# EAGLE design ROME (EAGLE 9.6.2)
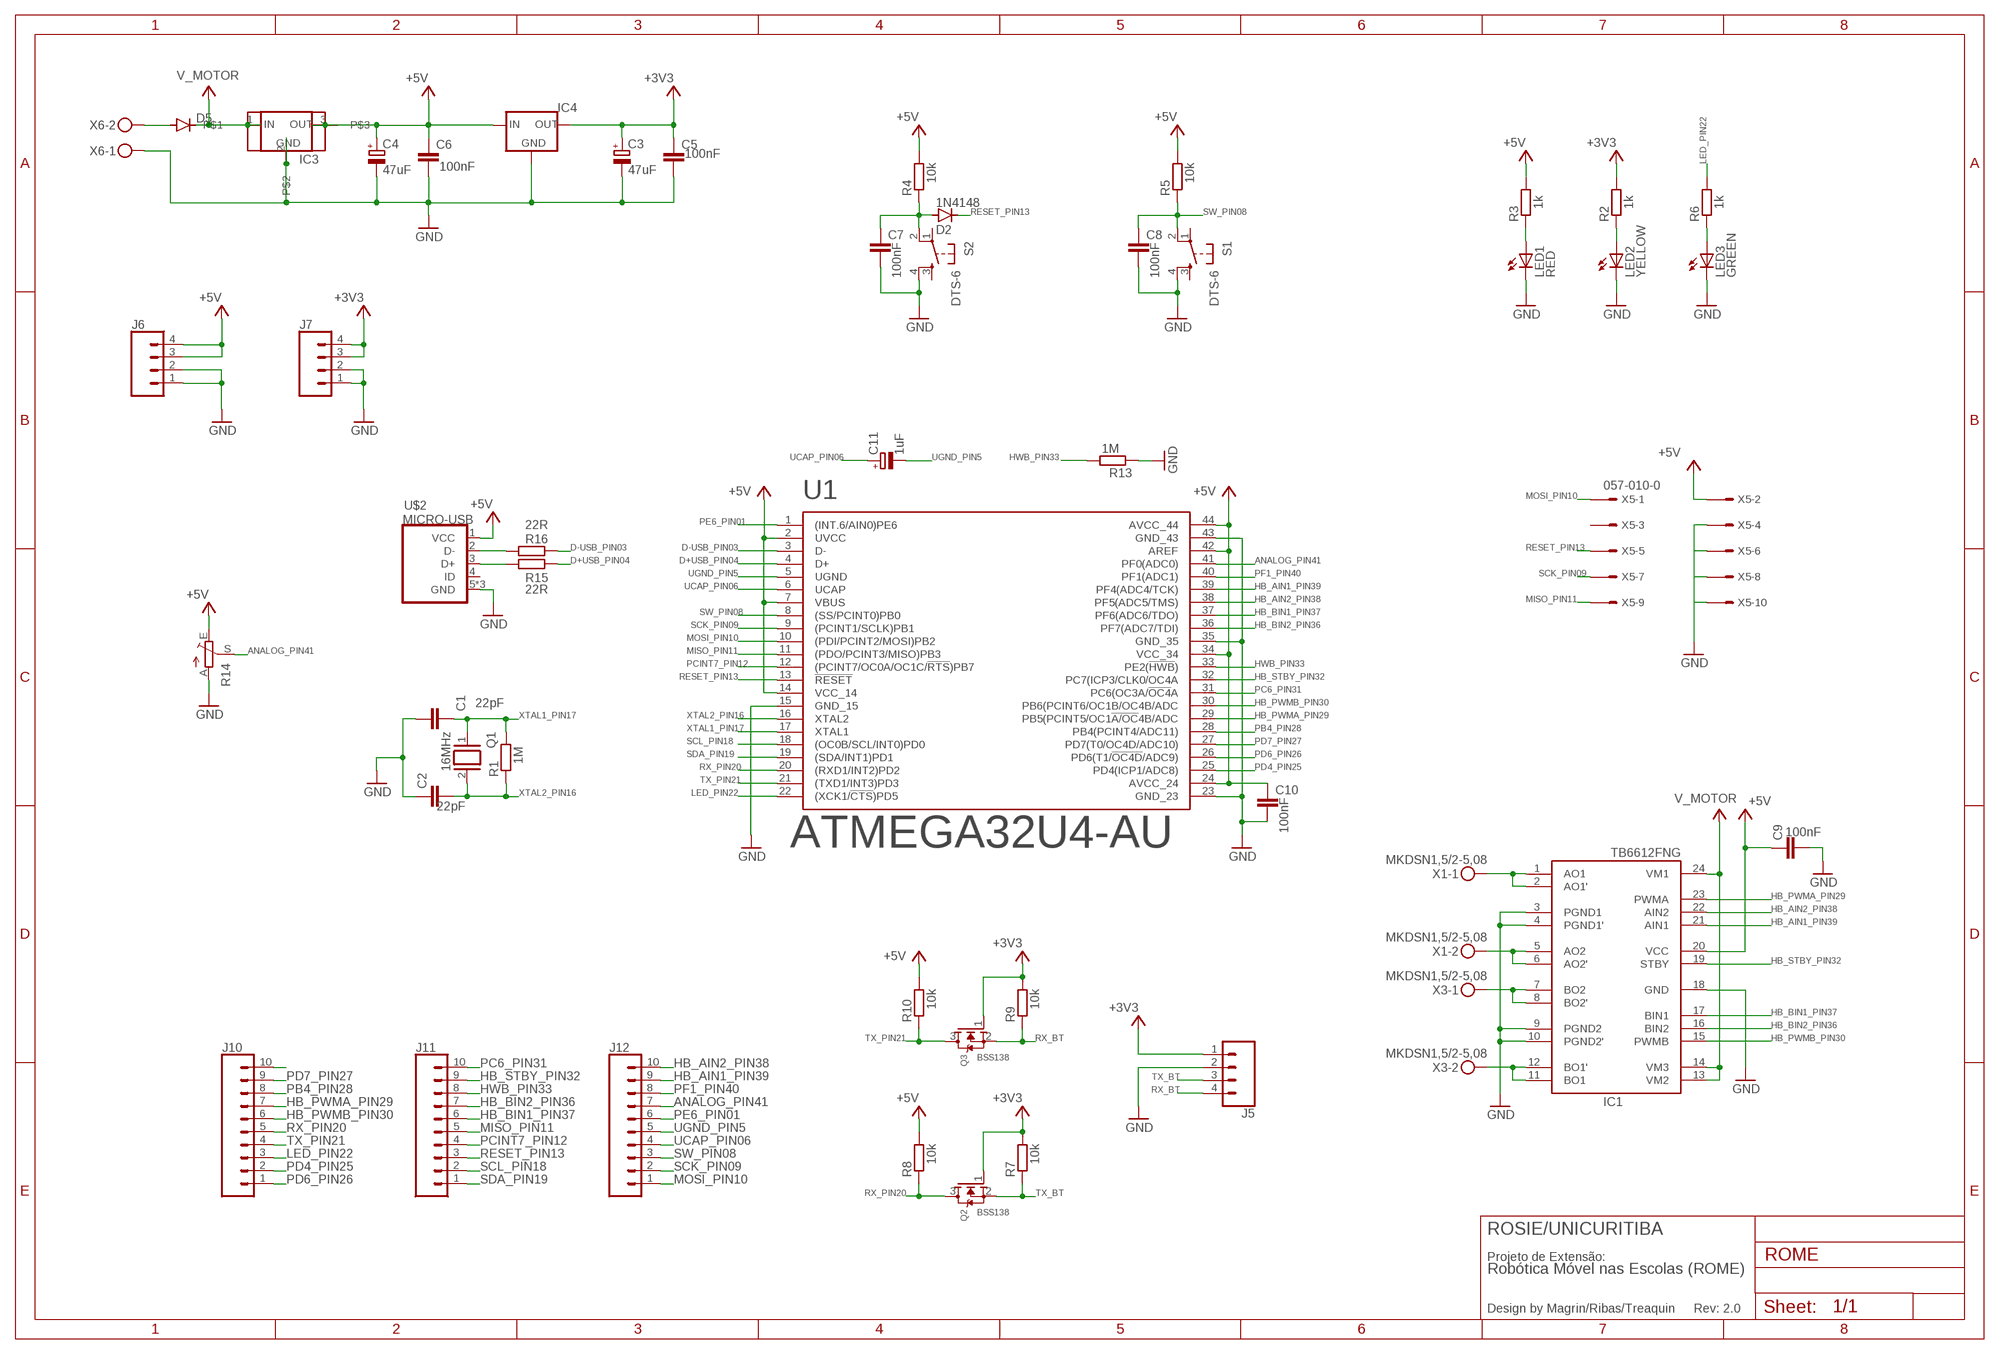
[diagram p0: schematic, sheet 1]

## Parts
C1  22pF  C-EUC0805  [C0805]
C2  22pF  C-EUC0805  [C0805]
C3  47uF  CPOL-EUC  [PANASONIC_C]
C4  47uF  CPOL-EUC  [PANASONIC_C]
C5  100nF  C-EUC0805  [C0805]
C6  100nF  C-EUC0805  [C0805]
C7  100nF  C-EUC0805  [C0805]
C8  100nF  C-EUC0805  [C0805]
C9  100nF  C-EUC0805  [C0805]
C10  100nF  C-EUC0805  [C0805]
C11  1uF  CPOL-EUC  [PANASONIC_C]
D2  1N4148  DIODE-SOD80C  [SOD80C]
D5  DIODE-DO214AC  [DO214AC]
IC1  TB6612FNG  [SSOP24]
IC3  78XXS  [78XXS]
IC4  LM1117MP-3.3  [SOT223]
J5  CONN_04PTH  [1X04]
J6  CONN_04PTH  [1X04]
J7  CONN_04PTH  [1X04]
J10  CONN_10"  [1X10]
J11  CONN_10"  [1X10]
J12  CONN_10"  [1X10]
LED1  RED  LEDCHIPLED_0805  [CHIPLED_0805]
LED2  YELLOW  LEDCHIPLED_0805  [CHIPLED_0805]
LED3  GREEN  LEDCHIPLED_0805  [CHIPLED_0805]
Q1  16MHz  XTAL/S  [QS]
Q2  BSS138  MOSFET-NREFLOW  [SOT23]
Q3  BSS138  MOSFET-NREFLOW  [SOT23]
R1  1M  R-EU_R0805  [R0805]
R2  1k  R-EU_R0805  [R0805]
R3  1k  R-EU_R0805  [R0805]
R4  10k  R-EU_R0805  [R0805]
R5  10k  R-EU_R0805  [R0805]
R6  1k  R-EU_R0805  [R0805]
R7  10k  R-EU_R0805  [R0805]
R8  10k  R-EU_R0805  [R0805]
R9  10k  R-EU_R0805  [R0805]
R10  10k  R-EU_R0805  [R0805]
R13  1M  R-EU_R0805  [R0805]
R14  TRIM_EU-CA6V  [CA6V]
R15  22R  R-EU_R0805  [R0805]
R16  22R  R-EU_R0805  [R0805]
S1  DTS-6  [DTS-6]
S2  DTS-6  [DTS-6]
U1  ATMEGA32U4-AU  [44-TQFP]
U$2  MICRO-USB  [MICRO-USB]
U$4  DPACK  [DPACK]
X1  MKDSN1,5/2-5,08  [MKDSN1,5/2-5,08]
X3  MKDSN1,5/2-5,08  [MKDSN1,5/2-5,08]
X5  057-010-0  [057-010-0]
X6  MKDSN1,5/2-5,08  [MKDSN1,5/2-5,08]

## Nets
+3V3: C3.+ C5.1 IC4.2(OUT) IC4.4(OUT) J5.1 J7.3 J7.4 Q2.1(G) Q3.1(G) R2.2 R7.2 R9.2
+5V: C4.+ C6.1 C9.1 C10.1 IC1.20(VCC) IC3.OUT IC4.3(IN) J6.3 J6.4 R3.2 R4.2 R5.2 R8.2 R10.2 R14.E U1.2(UVCC) U1.7(VBUS) U1.14(VCC_14) U1.24(AVCC_24) U1.34(VCC_34) U1.42(AREF) U1.44(AVCC_44) U$2.1(VCC) U$4.3 X5.2
ANALOG_PIN41: J12.7 R14.S U1.41(PF0(ADC0))
D+: R15.1 U$2.3(D+)
D+USB_PIN04: R15.2 U1.4(D+)
D-: R16.1 U$2.2(D-)
D-USB_PIN03: R16.2 U1.3(D-)
GND: C1.1 C2.1 C3.- C4.- C5.2 C6.2 C7.2 C8.2 C9.2 C10.2 IC1.3(PGND1) IC1.4(PGND1') IC1.9(PGND2) IC1.10(PGND2') IC1.18(GND) IC3.GND IC4.1(GND) J5.2 J6.1 J6.2 J7.1 J7.2 LED1.C LED2.C LED3.C R13.1 R14.A S1.4 S2.4 U1.15(GND_15) U1.23(GND_23) U1.35(GND_35) U1.43(GND_43) U$2.5(GND) U$2.GND1(GND) U$2.GND2(GND) U$4.2 X5.4 X5.6 X5.8 X5.10 X6.1
HB_AIN1_PIN39: IC1.21(AIN1) J12.9 U1.39(PF4(ADC4/TCK))
HB_AIN2_PIN38: IC1.22(AIN2) J12.10 U1.38(PF5(ADC5/TMS))
HB_AO1: IC1.1(AO1) IC1.2(AO1') X1.1
HB_AO2: IC1.5(AO2) IC1.6(AO2') X1.2
HB_BIN1_PIN37: IC1.17(BIN1) J11.6 U1.37(PF6(ADC6/TDO))
HB_BIN2_PIN36: IC1.16(BIN2) J11.7 U1.36(PF7(ADC7/TDI))
HB_BO1: IC1.11(BO1) IC1.12(BO1') X3.2
HB_BO2: IC1.7(BO2) IC1.8(BO2') X3.1
HB_PWMA_PIN29: IC1.23(PWMA) J10.7 U1.29(PB5(PCINT5/OC1!A/OC!4B/ADC)
HB_PWMB_PIN30: IC1.15(PWMB) J10.6 U1.30(PB6(PCINT6/OC1B/OC4B/ADC)
HB_STBY_PIN32: IC1.19(STBY) J11.9 U1.32(PC7(ICP3/CLK0/OC4A)
HWB_PIN33: J11.8 R13.2 U1.33(PE2(!HWB!))
LED_PIN22: J10.3 R6.2 U1.22((XCK1/!CTS!)PD5)
MISO_PIN11: J11.5 U1.11((PDO/PCINT3/MISO)PB3) X5.9
MOSI_PIN10: J12.1 U1.10((PDI/PCINT2/MOSI)PB2) X5.1
N$1: D5.A X6.2
N$11: LED1.A R3.1
N$12: LED2.A R2.1
N$14: C7.1 D2.A R4.1 S2.2
N$19: J10.10
N$20: LED3.A R6.1
PB4_PIN28: J10.8 U1.28(PB4(PCINT4/ADC11))
PC6_PIN31: J11.10 U1.31(PC6(OC3A/!OC4!A)
PCINT7_PIN12: J11.4 U1.12((PCINT7/OC0A/OC1C/!RTS!)PB7)
PD4_PIN25: J10.2 U1.25(PD4(ICP1/ADC8))
PD6_PIN26: J10.1 U1.26(PD6(T1/!OC4D!/ADC9))
PD7_PIN27: J10.9 U1.27(PD7(T0/OC4D/ADC10))
PE6_PIN01: J12.6 U1.1((INT.6/AIN0)PE6)
PF1_PIN40: J12.8 U1.40(PF1(ADC1))
RESET_PIN13: D2.C J11.3 U1.13(!RESET) X5.5
RX_BT: J5.4 Q3.2(S) R9.1
RX_PIN20: J10.5 Q2.3(D) R8.1 U1.20((RXD1/INT2)PD2)
SCK_PIN09: J12.2 U1.9((PCINT1/SCLK)PB1) X5.7
SCL_PIN18: J11.2 U1.18((OC0B/SCL/INT0)PD0)
SDA_PIN19: J11.1 U1.19((SDA/INT1)PD1)
SW_PIN08: C8.1 J12.3 R5.1 S1.2 U1.8((SS/PCINT0)PB0)
TX_BT: J5.3 Q2.2(S) R7.1
TX_PIN21: J10.4 Q3.3(D) R10.1 U1.21((TXD1/INT3)PD3)
UCAP_PIN06: C11.+ J12.4 U1.6(UCAP)
UGND_PIN5: C11.- J12.5 U1.5(UGND)
V+: D5.C IC1.13(VM2) IC1.14(VM3) IC1.24(VM1) IC3.IN U$4.1 ; supply symbol labelled V_MOTOR
XTAL1_PIN17: C1.2 Q1.1 R1.2 U1.17(XTAL1)
XTAL2_PIN16: C2.2 Q1.2 R1.1 U1.16(XTAL2)
Unconnected: S1.1 S1.3 S2.1 S2.3 U$2.4(ID) X5.3

## Notes on the sheet
- ROSIE/UNICURITIBA
- Projeto de Extensão:
- Robótica Móvel nas Escolas (ROME)
- Design by Magrin/Ribas/Treaquin | Rev: 2.0

## Library data of the parts
C1 C2 C5-C10 = rcl:C-EU: CAPACITOR, European symbol; SPICEPREFIX: C
C3 C4 C11 = rcl:CPOL-EU: POLARIZED CAPACITOR, European symbol; SPICEPREFIX: C
D2 D5 = diode:DIODE-: DIODE
IC1 = adafruit:TB6612FNG: TB6612FNG MOS dual H-bridge motor driver, 1.2A current 3.2A peak 3 or 5v logic and 3-15v motor
IC3 = v-reg:78XXS: VOLTAGE REGULATOR
IC4 = lm1117_10:LM1117?-*: 800mA Low-Dropout Linear Regulator Source: http://www.ti.com/lit/ds/symlink/lm1117-n.pdf; MF: Texas Instruments; MPN: LM1117MP-3.3; OC_FARNELL: 9778195; OC_NEWARK: 28X3416
J5-J7 = SparkFun-Connectors:CONN_04: Multi connection point. Often used as Generic Header-pin footprint for 0.1 inch spaced/style header connections On any of the 0.1 inch spaced packages, you can populate with these: Break Away Headers - Straight <https://www.sparkfun.com/products/116> (PRT-00116) Break Away Male Headers - Right Angle <https://www.sparkfun.com/products/553> (PRT-00553) Female Headers <https://www.sparkfun.com/products/115> (PRT-00115) Break Away Headers - Machine Pin <https://www.sparkfun.com/products/117> (PRT-00117) Break Away Female Headers - Swiss Machine Pin <https://www.sparkfun.com/products/743> (PRT-00743) For SCREWTERMINALS and SPRING TERMINALS visit here: Screw Terimnals on SparkFun.com <https://www.sparkfun.com/search/results?term=Screw+Terminals> (5mm/3.5mm/2.54mm spacing) This device is also useful as a general connection point to wire up your design to another part of your project. Our various solder wires solder well into these plated through hole pads. Hook-Up Wire - Assortment (Stranded, 22 AWG) <https://www.sparkfun.com/products/11375> (PRT-11375) Hook-Up Wire - Assortment (Solid Core, 22 AWG) <https://www.sparkfun.com/products/11367> (PRT-11367) View the entire wire category on our website here <https://www.sparkfun.com/categories/141> Special notes: Molex polarized connector foot print use with SKU : PRT-08231 with associated crimp pins and housings. 1MM SMD Version SKU: PRT-10208; PROD_ID: CONN-09696
J10-J12 = SparkFun-Connectors:CONN_10: Multi connection point. Often used as Generic Header-pin footprint for 0.1 inch spaced/style header connections On any of the 0.1 inch spaced packages, you can populate with these: Break Away Headers - Straight <https://www.sparkfun.com/products/116> (PRT-00116) Break Away Male Headers - Right Angle <https://www.sparkfun.com/products/553> (PRT-00553) Female Headers <https://www.sparkfun.com/products/115> (PRT-00115) Break Away Headers - Machine Pin <https://www.sparkfun.com/products/117> (PRT-00117) Break Away Female Headers - Swiss Machine Pin <https://www.sparkfun.com/products/743> (PRT-00743) Arduino Stackable Header - 10 Pin <https://www.sparkfun.com/products/11376> (PRT-11376) For SCREWTERMINALS and SPRING TERMINALS visit here: Screw Terimnals on SparkFun.com <https://www.sparkfun.com/search/results?term=Screw+Terminals> (5mm/3.5mm/2.54mm spacing) This device is also useful as a general connection point to wire up your design to another part of your project. Our various solder wires solder well into these plated through hole pads. Hook-Up Wire - Assortment (Stranded, 22 AWG) <https://www.sparkfun.com/products/11375> (PRT-11375) Hook-Up Wire - Assortment (Solid Core, 22 AWG) <https://www.sparkfun.com/products/11367> (PRT-11367) View the entire wire category on our website here <https://www.sparkfun.com/categories/141> Special notes: Molex polarized connector foot print use with SKU : PRT-08231 with associated crimp pins and housings. 1MM SMD Version SKU: PRT-10208 NOTES ON THE VARIANTS LOCK and LOCK_LONGPADS... This footprint was designed to help hold the alignment of a through-hole component (i.e. 6-pin header) while soldering it into place. You may notice that each hole has been shifted either up or down by 0.005 of an inch from it's more standard position (which is a perfectly straight line). This slight alteration caused the pins (the squares in the middle) to touch the edges of the holes. Because they are alternating, it causes a "brace" to hold the component in place. 0.005 has proven to be the perfect amount of "off-center" position when using our standard breakaway headers. Although looks a little odd when you look at the bare footprint, once you have a header in there, the alteration is very hard to notice. Also,if you push a header all the way into place, it is covered up entirely on the bottom side.; PROD_ID: CONN-11563
LED1-LED3 = adafruit:LED: LED OSRAM: - CHIPLED LG R971, LG N971, LY N971, LG Q971, LY Q971, LO R971, LY R971 LH N974, LH R974 LS Q976, LO Q976, LY Q976 LO Q996 - Hyper CHIPLED LW Q18S LB Q993, LB Q99A, LB R99A - SideLED LS A670, LO A670, LY A670, LG A670, LP A670 LB A673, LV A673, LT A673, LW A673 LH A674 LY A675 LS A676, LA A676, LO A676, LY A676, LW A676 LS A679, LY A679, LG A679 - Hyper Micro SIDELED® LS Y876, LA Y876, LO Y876, LY Y876 LT Y87S - SmartLED LW L88C, LW L88S LB L89C, LB L89S, LG L890 LS L89K, LO L89K, LY L89K LS L896, LA L896, LO L896, LY L896 - TOPLED LS T670, LO T670, LY T670, LG T670, LP T670 LSG T670, LSP T670, LSY T670, LOP T670, LYG T670 LG T671, LOG T671, LSG T671 LB T673, LV T673, LT T673, LW T673 LH T674 LS T676, LA T676, LO T676, LY T676, LB T676, LH T676, LSB T676, LW T676 LB T67C, LV T67C, LT T67C, LS T67K, LO T67K, LY T67K, LW E67C LS E67B, LA E67B, LO E67B, LY E67B, LB E67C, LV E67C, LT E67C LW T67C LS T679, LY T679, LG T679 LS T770, LO T770, LY T770, LG T770, LP T770 LB T773, LV T773, LT T773, LW T773 LH T774 LS E675, LA E675, LY E675, LS T675 LS T776, LA T776, LO T776, LY T776, LB T776 LHGB T686 LT T68C, LB T68C - Hyper Mini TOPLED® LB M676 - Mini TOPLED Santana® LG M470 LS M47K, LO M47K, LY M47K Source: http://www.osram.convergy.de/
Q1 = special:XTAL/S: CRYSTAL
Q2 Q3 = adafruit:MOSFET-N: N-Channel Mosfet 2N7002E - 60V 260mA SOT23 [Digikey: 2N7002ET1GOSTR-ND] - REEL BSH103 - 30V 850mA SOT23 [Digikey: 568-5013-1-ND]
R1-R10 R13 R15 R16 = rcl:R-EU_: RESISTOR, European symbol; SPICEPREFIX: R
R14 = pot:TRIM_EU-: POTENTIOMETER
S1 S2 = switch-tact:DTS-6
U1 = Microcontroller:ATMEGA32U4-AU: IC MCU 8BIT 32KB FLASH 44TQFP Manufacturer's datasheet <http://ww1.microchip.com/downloads/en/DeviceDoc/Atmel-7766-8-bit-AVR-ATmega16U4-32U4_Summary.pdf>; CREATED_BY: PCBLayout.com; DIGIKEY_PART_NUMBER: ATMEGA32U4-AU-ND; MANUFACTURER: Microchip Technology; MPN: ATMEGA32U4-AU; PACKAGE: 44-TQFP
U$2 = microusb:MICRO-USB: Micro USB B connector
U$4 = linear:DPACK
X1 X3 X6 = con-phoenix-508:MKDSN1,5/2-5,08: MKDSN 1,5/ 2-5,08 Printklemme Nennstrom: 13,5 A Nennspannung: 250 V Rastermaß: 5,08 mm Polzahl: 2 Anschlussart: Schraubanschluss Montage: Löten Anschlussrichtung Leiter/Platine: 0 ° Artikelnummer: 1729128 Source: http://eshop.phoenixcontact.com .. 1729128.pdf
X5 = con-panduit:057-010-: CONNECTOR 10-pin series 057 contact pc board low profile headers; OC_FARNELL: unknown; OC_NEWARK: unknown

## Board
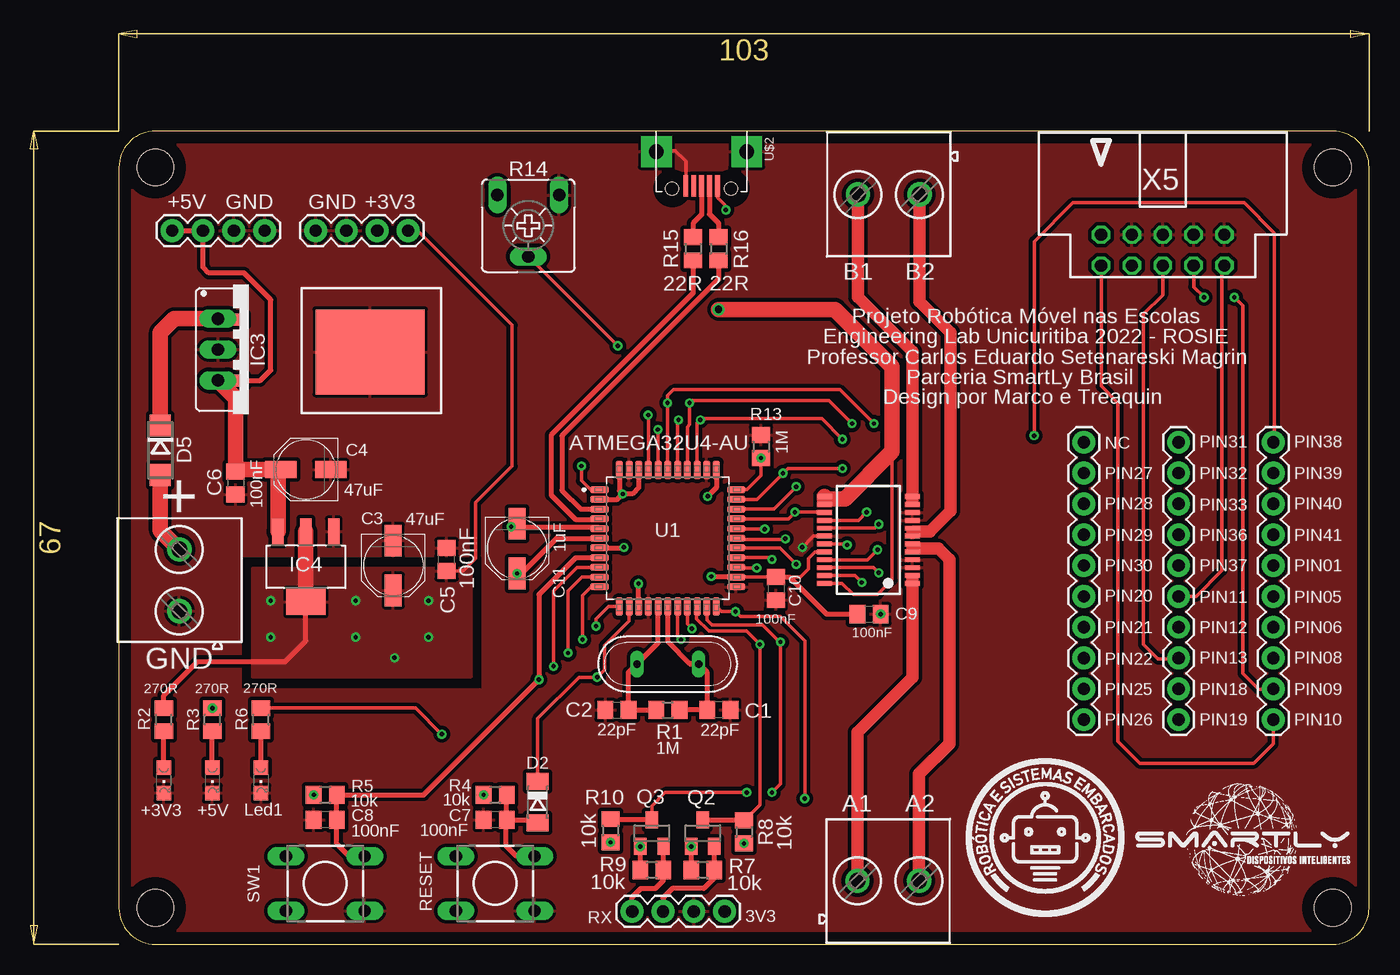
[diagram p1: board, top side]
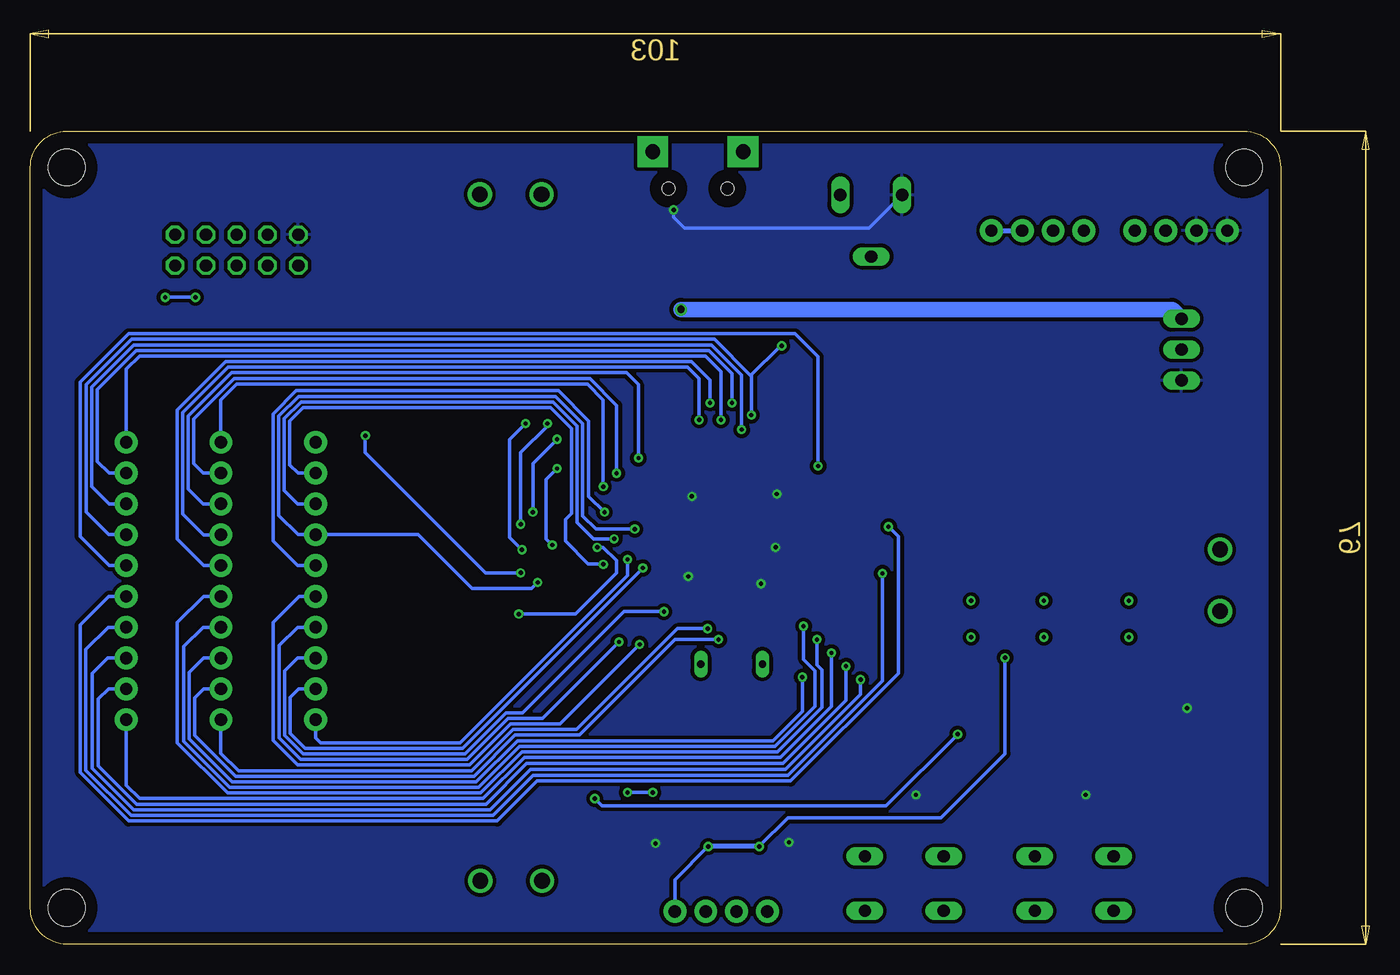
[diagram p2: board, bottom side, seen from below]

Size 103 x 67 mm. Coordinates in mm from the lower left corner, seen from the top.
Outline: 0,64 0,3 arc90 3,0 100,0 arc90 103,3 103,64 arc90 100,67 3,67 arc90 0,64
Copper layers (1*16): Top 0.035mm / dielectric 1.5mm / Bottom 0.035mm
Design rules "default *": minimum track width 6mil, minimum drill 0.35mm, track to track 6mil, track to pad 6mil, pad to pad 6mil, via to via 6mil, smd to smd 6mil, copper to edge 40mil, drill to drill 6mil, minimum pad ring 10mil, minimum via ring 8mil, stop-mask expansion 4mil, vias tented up to drill 0mil, thermal gap 10mil
Holes 3 mm at 3,3 3,64 100,64 100,3

### Footprints (pad centres in the part's own frame; a part is rotated, then mirrored left to right if it is on the bottom)
C0805 = smd 1.3 x 1.5: 1 -0.95,0; 2 0.95,0
PANASONIC_C = smd 2.6 x 1.4: + 2.05,0; - -2.05,0
SOD80C = smd 1.4 x 1.8: A 1.7,0; C -1.7,0
DO214AC = smd 1.8 x 1.7: A 2.05,0; C -2.05,0
SSOP24 = smd 0.4 x 1.25: 1 -3.575,-3.625; 2 -2.925,-3.625; 3 -2.275,-3.625; 4 -1.625,-3.625; 5 -0.975,-3.625; 6 -0.325,-3.625; 7 0.325,-3.625; 8 0.975,-3.625; 9 1.625,-3.625; 10 2.275,-3.625; 11 2.925,-3.625; 12 3.575,-3.625; 13 3.575,3.625; 14 2.925,3.625; 15 2.275,3.625; 16 1.625,3.625; 17 0.975,3.625; 18 0.325,3.625; 19 -0.325,3.625; 20 -0.975,3.625; 21 -1.625,3.625; 22 -2.275,3.625; 23 -2.925,3.625; 24 -3.575,3.625
78XXS = drill 1.016 long: GND 0,-2.54; IN -2.54,-2.54; OUT 2.54,-2.54
SOT223 = smd 0.95 x 2.15: 1 -2.3,-2.9; 2 0,-2.9; 3 2.3,-2.9 | smd 3.25 x 2.15: 4 0,2.9
1X04 = drill 1.016 pad 1.88: 1 0,0; 2 2.54,0; 3 5.08,0; 4 7.62,0
1X10 = drill 1.016 pad 1.88: 1 0,0; 2 2.54,0; 3 5.08,0; 4 7.62,0; 5 10.16,0; 6 12.7,0; 7 15.24,0; 8 17.78,0; 9 20.32,0; 10 22.86,0
CHIPLED_0805 = smd 1.2 x 1.2: A 0,-1.05; C 0,1.05
QS = drill 0.61 long: 1 -2.54,0; 2 2.54,0
SOT23 = smd 1 x 1.4: 1 -0.95,-1.1; 2 0.95,-1.1; 3 0,1.1
R0805 = smd 1.3 x 1.5: 1 -0.95,0; 2 0.95,0
CA6V = drill 1.016 long: A -2.54,-2.54; E 2.54,-2.54; S 0,2.54
DTS-6 = drill 1 long: 1 -3.25,2.25; 2 3.25,2.25; 3 -3.25,-2.25; 4 3.25,-2.25
44-TQFP = smd 1.5 x 0.57: 1 -5.63,4; 2 -5.63,3.2; 3 -5.63,2.4; 4 -5.63,1.6; 5 -5.63,0.8; 6 -5.63,0; 7 -5.63,-0.8; 8 -5.63,-1.6; 9 -5.63,-2.4; 10 -5.63,-3.2; 11 -5.63,-4; 23 5.63,-4; 24 5.63,-3.2; 25 5.63,-2.4; 26 5.63,-1.6; 27 5.63,-0.8; 28 5.63,0; 29 5.63,0.8; 30 5.63,1.6; 31 5.63,2.4; 32 5.63,3.2; 33 5.63,4 | smd 0.57 x 1.5: 12 -4,-5.63; 13 -3.2,-5.63; 14 -2.4,-5.63; 15 -1.6,-5.63; 16 -0.8,-5.63; 17 0,-5.63; 18 0.8,-5.63; 19 1.6,-5.63; 20 2.4,-5.63; 21 3.2,-5.63; 22 4,-5.63; 34 4,5.63; 35 3.2,5.63; 36 2.4,5.63; 37 1.6,5.63; 38 0.8,5.63; 39 0,5.63; 40 -0.8,5.63; 41 -1.6,5.63; 42 -2.4,5.63; 43 -3.2,5.63; 44 -4,5.63
MICRO-USB = smd 0.4 x 1.75: 1 -1.3,4.525; 2 -0.65,4.525; 3 0,4.525; 4 0.65,4.525; 5 1.3,4.525 | drill 1.2 pad 2.54 square: GND1 -3.725,1.7; GND2 3.725,1.7 | hole 1.05: -2.425,4.73; 2.425,4.73
DPACK = smd 1 x 1.6: 1 -0.657,-7.455; 3 4.349,-7.451 | smd 7 x 9: 2 2,3.5
MKDSN1,5/2-5,08 = drill 1.3 pad 2: 1 -2.561,0.025; 2 2.519,0.025
057-010-0 = drill 1 octagon: 1 -5.08,-5.08; 2 -5.08,-2.54; 3 -2.54,-5.08; 4 -2.54,-2.54; 5 0,-5.08; 6 0,-2.54; 7 2.54,-5.08; 8 2.54,-2.54; 9 5.08,-5.08; 10 5.08,-2.54

### Placement (x,y rotation side)
C1  49.43,19.3 180 top
C2  41.03,19.3 0 top
C3  22.6,31.2 270 top
C4  15.4,39.1 180 top
C5  27,31.7 90 top
C6  9.6,38 270 top
C7  31,10.25 180 top
C8  17,10.25 180 top
C9  61.8,27.2 0 top
C10  54.12,29.3 270 top
C11  32.8,32.6 270 top
D2  34.5,11.7 270 top
D5  3.4,40.7 270 top
IC1  61.75,33.3 90 top
IC3  10.7,49 270 top
IC4  15.4,31.1 180 top
J5  49.9,2.7 180 top
J6  12,58.8 180 top
J7  16.2,58.8 0 top
J10  79.5,18.5 90 top
J11  87.3,18.5 90 top
J12  95.1,18.5 90 top
LED1  7.7,13.5 180 top
LED2  3.7,13.5 180 top
LED3  11.7,13.5 180 top
Q1  45.22,23.09 180 top
Q2  48.1,9.15 0 top
Q3  43.9,9.15 0 top
R1  45.22,19.3 0 top
R2  3.7,18.5 90 top
R3  7.7,18.5 90 top
R4  31,12.3 180 top
R5  17,12.3 180 top
R6  11.7,18.5 90 top
R7  48.1,6.1 180 top
R8  51.5,9.25 270 top
R9  43.9,6.1 180 top
R10  40.5,9.35 270 top
R13  52.9,41 270 top
R14  33.72,59.2 180 top
R15  47.3,57.3 270 top
R16  49.4,57.3 270 top
S1  17,5 0 top
S2  31,5 0 top
U1  45.22,33.45 0 top
U$2  48,67 180 top
U$4  17.2,50.8 270 top
X1  63.4,5.2 0 top
X3  63.4,61.8 180 top
X5  86,61 0 top
X6  5,30 90 top

### Tracks (layer width: path | path; a pad name or v marks a point on that pad's centre or on a via)
+3V3  (via drill 0.35)
  Top 0.305: C5.1 28.35,30.75 29.4,31.8 29.4,36.4 32.4,39.4 32.4,51 24.6,58.8 J7.4
  Top 0.406: R2.2 3.7,20.5 6.5,23.3 13.7,23.3 15.4,25 IC4.4 | R9.2 Q3.1 | R7.2 Q2.1
  Top 1.27: IC4.2 IC4.4
  Bottom 0.305: Q3.1 40.6,10.4 28,10.4 22.7,15.7 v22.7,23.6 | J5.1 49.9,5.3 Q2.1
  Bottom 0.406: J7.4 J7.3 | Q3.1 Q2.1
  other vias: 42.95,8.05 47.15,8.05 12.5,28.3 19.5,28.3 19.5,25.3 12.5,25.3 25.5,25.3 25.5,28.3
  pour Top: 11,31 29,31 29,22 11,22
+5V  (via drill 0.35)
  Top 0.305: U1.24 C10.1 | U$2.1 49.3,61.5 50,60.8 v50,60.5 | IC1.20 57.32,32.33 56.8,31.8 56.8,30.9 56.15,30.25 55.25,30.25
  Top 0.406: U$4.3 11.65,46.45 12.5,47.3 12.5,53.1 10.3,55.3 7.4,55.3 6.92,55.78 J6.3 J6.4 | U1.7 41.55,32.65 v41.6,32.7 | U1.14 42.82,29.68 v42.8,29.7 | U1.24 48.85,30.25 v48.8,30.3 | U1.2 41.05,36.65 v41.5,37.1 | U1.44 41.22,37.38 v41.5,37.1 | U1.42 42.82,37.62 42.3,37.1 v41.5,37.1 | U1.34 49.22,37.62 v48.5,36.9 | C10.1 55.25,30.25 58.3,27.2 C9.1
  Top 1.27: IC3.OUT 9.6,45.02 C6.1 9.75,39.1 C4.+ 13.1,38.85 IC4.3
  Bottom 0.305: v50,60.5 50,59.9 49.1,59 33.92,59 R14.E
  other vias: 7.7,19.45 16.05,12.3 30.05,12.3 40.5,8.4 51.5,8.3
  pour Bottom (isolate 0.305): 0,0 0,67 103,67 103,0
ANALOG_PIN41  (via drill 0.35)
  Top 0.305: v43.6,43.6 43.62,43.58 U1.41 | R14.S 33.74,56.66 v41.1,49.3
  Bottom 0.305: J12.7 96.54,33.74 98.4,35.6 98.4,46.1 94.66,49.84 46.64,49.84 43.65,46.85 | v43.6,43.6 43.6,46.8 43.65,46.85 | 43.65,46.85 41.2,49.3 v41.1,49.3
D+
  Top 0.406: U$2.3 48,60.1 47.3,59.4 R15.1
D+USB_PIN04
  Top 0.406: R15.2 47.3,53.65 35.6,41.95 35.6,37 37.6,35 39.54,35 U1.4
D-
  Top 0.406: U$2.2 48.65,60.15 49.4,59.4 R16.1
D-USB_PIN03
  Top 0.406: R16.2 49.4,54.8 36.5,41.9 36.5,37.4 38.05,35.85 U1.3
GND  (via drill 0.35)
  Top 0.305: U$2.5 46.7,64.5 45.8,65.4 44.38,65.4 U$2.GND2 | IC1.18 57.22,33.62 v56.3,32.7
  Bottom 0.305: v56.3,32.7 55.8,32.7 54.7,31.6 54.7,30.6 58.1,27.2 C9.2
  other vias: 62.75,27.2
  pour Top (isolate 0.305): 0,0 0,67 103,67 103,0 30,0 30,32 10,32 10,21 29.75,21 29.75,0
HB_AIN1_PIN39  (via drill 0.35)
  Top 0.305: U1.39 45.2,39.1 v45.2,44.6 45.2,45.2 45.7,45.7 59.4,45.7 v62.2,42.9 | IC1.21 61.68,31.68 v62.5,32.5
  Bottom 0.305: J12.9 96.52,38.82 97.49,39.79 97.49,45.72 94.28,48.93 47.1,48.93 45.2,47.03 v45.2,44.6 | v62.5,32.5 63.5,33.5 63.5,41.6 v62.2,42.9
HB_AIN2_PIN38  (via drill 0.35)
  Top 0.305: U1.38 46.03,43.12 v46.1,43.2 | IC1.22 62.18,31.02 v62.6,30.6 | v75.4,41.9 75.4,57.9 78.6,61.1 92.7,61.1 95.2,58.6 95.2,41.46 J12.10
  Bottom 0.305: v46.1,43.2 46.1,47.2 47.37,48.47 94,48.47 95.1,47.37 J12.10 | v62.6,30.6 65.5,30.6 75.4,40.5 v75.4,41.9
HB_AO1
  Top 0.254: IC1.1 65.38,30.1 IC1.2
  Top 1.016: 65.38,30.1 65.38,21.98 60.84,17.44 X1.1
HB_AO2
  Top 0.254: IC1.5 65.38,32.6 IC1.6
  Top 1.016: X1.2 65.92,14.02 68.4,16.5 68.4,31.7 67.5,32.6 65.38,32.6
HB_BIN1_PIN37  (via drill 0.35)
  Top 0.305: U1.37 46.82,42.62 47,42.8 v47,44.6 47.2,44.8 58.5,44.8 v60.4,42.9 | IC1.17 62.28,34.27 v62.6,34.6
  Bottom 0.305: J11.6 88.7,31.2 90.9,33.4 90.9,44.01 86.9,48.01 48.51,48.01 47,46.5 v47,44.6 | v62.6,34.6 62.6,40.5 60.4,42.7 v60.4,42.9
HB_BIN2_PIN36  (via drill 0.35)
  Top 0.305: U1.36 47.62,42.92 v47.9,43.2 48,43.3 57.9,43.3 v59.6,41.6 | IC1.16 60.93,34.92 v61.6,35.6
  Bottom 0.305: v47.9,43.2 47.9,46.6 48.86,47.56 86.69,47.56 90.44,43.8 90.44,35.44 88.7,33.7 87.34,33.7 J11.7 | v61.6,35.6 61.6,39.6 v59.6,41.6
HB_BO1
  Top 0.203: IC1.11 65.38,36.5 IC1.12
  Top 1.016: X3.2 60.88,53.32 65.38,48.83 65.38,36.5
HB_BO2
  Top 0.254: IC1.8 65.38,33.9 IC1.7
  Top 1.016: 65.38,33.9 65.47,34 66.8,34 68.5,35.7 68.5,50.4 65.96,52.94 X3.1
HB_PWMA_PIN29  (via drill 0.35)
  Top 0.305: v53.2,34.2 50.91,34.2 U1.29 | IC1.23 60.62,30.38 v61.2,29.8
  Bottom 0.305: v53.2,34.2 56.4,34.2 57.5,35.3 57.5,42.9 59.74,45.14 80.9,45.14 82.54,43.5 82.54,35.34 80.94,33.74 J10.7 71.04,33.74 66.6,29.3 61.7,29.3 v61.2,29.8
HB_PWMB_PIN30  (via drill 0.35)
  Top 0.305: IC1.15 58.1,35.6 v55.7,35.6 55.15,35.05 U1.30
  Bottom 0.305: J10.6 80.98,31.2 83,33.22 83,43.7 81.1,45.6 59.5,45.6 57,43.1 57,36.9 v55.7,35.6
HB_STBY_PIN32  (via drill 0.35)
  Top 0.305: U1.32 52.55,36.65 v54.7,38.8 55.1,39.2 v59.6,39.2 | IC1.19 59.93,32.98 v60,32.9
  Bottom 0.305: J11.9 88.75,38.82 89.53,39.6 89.53,43.27 86.2,46.6 56.9,46.6 54.7,44.4 v54.7,38.8 | v60,32.9 60.5,33.4 60.5,38.3 v59.6,39.2
HWB_PIN33  (via drill 0.35)
  Top 0.305: U1.33 51.75,37.45 52.9,38.6 R13.2
  Bottom 0.305: J11.8 88.77,36.28 89.99,37.5 89.99,43.51 86.4,47.1 53.9,47.1 52.9,46.1 R13.2
  other vias: 52.9,40.05
LED_PIN22  (via drill 0.35)
  Top 0.305: U1.22 49.65,27.4 v50.8,27.4 51.2,27 54.5,27 56.5,25 v56.5,12 | R6.2 24.45,19.45 v26.6,17.3
  Bottom 0.305: J10.3 80.96,23.58 82.04,22.5 82.04,17.19 80.53,15.68 67.19,15.68 63.81,19.06 62.44,19.06 54.1,27.4 v50.8,27.4 | v26.6,17.3 32.5,11.4 55.9,11.4 v56.5,12
MISO_PIN11  (via drill 0.35)
  Top 0.305: v38.2,25.1 38.2,28.75 38.9,29.45 U1.11 | X5.9 90.88,55.72 90.88,30.78 88.76,28.66 J11.5
  Bottom 0.305: J11.5 88.74,28.66 90.9,26.5 90.9,16.6 86.76,12.46 65.89,12.46 62.49,15.86 41.44,15.86 37.8,19.5 37.8,22.6 38.2,23 v38.2,25.1
MOSI_PIN10  (via drill 0.35)
  Top 0.305: U1.10 38.15,30.25 37,29.1 v37,24 | X5.1 80.92,45.98 82.3,44.6 82.3,16.7 84.1,14.9 93.5,14.9 95.1,16.5 J12.1
  Bottom 0.305: J12.1 95.1,13.1 94,12 65.7,12 62.3,15.4 41.2,15.4 37,19.6 v37,24
N$1
  Top 1.27: X6.2 3.4,34.09 D5.A
N$11
  Top 0.406: LED1.A R3.1
N$12
  Top 0.406: LED2.A R2.1
N$14
  Top 0.406: S2.2 32.75,7.25 31.9,8.1 31.9,10.2 C7.1 | C7.1 R4.1 | C7.1 34.25,10.25 D2.A
N$20
  Top 0.406: LED3.A R6.1
PB4_PIN28  (via drill 0.35)
  Top 0.305: U1.28 50.96,33.35 54.85,33.35 v54.9,33.4
  Bottom 0.305: v54.9,33.4 56.6,33.4 57.96,34.76 57.96,42.71 59.92,44.68 80.71,44.68 82.09,43.3 82.09,37.39 80.98,36.28 J10.8
PC6_PIN31  (via drill 0.35)
  Top 0.305: U1.31 53.95,35.85 v55.8,37.7
  Bottom 0.305: v55.8,37.7 55.8,44.85 57.09,46.14 86,46.14 87.3,44.84 J11.10
PCINT7_PIN12  (via drill 0.35)
  Top 0.305: U1.12 40.32,27.82 39.3,26.8 v39.3,26.2
  Bottom 0.305: J11.4 88.78,26.12 90.38,24.52 90.38,16.72 86.57,12.91 66.08,12.91 62.68,16.31 41.63,16.31 38.36,19.59 38.36,22.51 39.3,23.45 v39.3,26.2
PD4_PIN25  (via drill 0.35)
  Top 0.305: v52.54,31 50.91,31 U1.25
  Bottom 0.305: J10.2 80.9,21.04 81.59,20.35 81.59,17.38 80.34,16.14 67.39,16.14 v52.54,30.99 v52.54,31
PD6_PIN26  (via drill 0.35)
  Top 0.305: v53.8,31.7 53.65,31.85 U1.26
  Bottom 0.305: v53.8,31.7 53.8,30.4 67.61,16.59 79.09,16.59 79.5,17 J10.1
PD7_PIN27  (via drill 0.35)
  Top 0.305: U1.27 54.45,32.65 v55.8,31.3
  Bottom 0.305: J10.9 80.95,38.82 81.63,39.5 81.63,43.11 80.52,44.22 60.13,44.22 58.41,42.5 58.41,35.5 58.91,35 58.91,33.21 57.05,31.35 55.85,31.35 v55.8,31.3
PE6_PIN01  (via drill 0.35)
  Top 0.305: v38.1,39.4 38.1,38.2 38.85,37.45 U1.1
  Bottom 0.305: J12.6 96.5,31.2 98.9,33.6 98.9,46.3 94.9,50.3 40,50.3 38.1,48.4 v38.1,39.4
PF1_PIN40  (via drill 0.35)
  Top 0.305: U1.40 44.43,42.38 v44.4,42.4
  Bottom 0.305: v44.4,42.4 44.4,46.9 46.89,49.39 94.47,49.39 97.94,45.91 97.94,37.7 96.52,36.28 J12.8
RESET_PIN13  (via drill 0.35)
  Top 0.305: D2.C 34.5,18.6 37.9,22 v39.4,22 40,22.6 40,24.6 42.03,26.62 U1.13 | X5.5 86,53.5 84.4,51.9 84.4,24.7 85.6,23.5 87.22,23.5 J11.3
  Bottom 0.305: J11.3 88.72,23.58 89.92,22.38 89.92,16.91 86.38,13.37 66.27,13.37 62.87,16.77 41.82,16.77 39.4,19.19 v39.4,22
RX_BT
  Top 0.406: Q3.2 R9.1 44.85,5.25 44.2,4.6 43,4.6 42.28,3.88 J5.4
RX_PIN20  (via drill 0.35)
  Top 0.305: R8.1 52.8,11.5 v52.8,24.7 51.7,25.8 48.6,25.8 47.6,26.8 47.6,27.8 U1.20
  Top 0.406: R8.1 48.15,10.2 Q2.3
  Bottom 0.305: v52.8,24.7 59.36,18.14 63.44,18.14 66.82,14.76 80.96,14.76 83,16.8 83,26.5 80.84,28.66 J10.5
SCK_PIN09  (via drill 0.35)
  Top 0.305: U1.9 37.75,31.05 35.8,29.1 v35.8,22.9 | X5.7 88.54,54.16 v89.4,53.3 | v91.9,53.3 92.6,52.6 92.6,22.3 93.9,21 95.06,21 J12.2
  Bottom 0.305: v35.8,22.9 35.8,20.1 41,14.9 62.1,14.9 65.47,11.53 94.23,11.53 97.4,14.7 97.4,20.2 96.56,21.04 J12.2 | v89.4,53.3 v91.9,53.3
SCL_PIN18  (via drill 0.35)
  Top 0.305: v46.3,25.1 46.03,25.38 U1.18
  Bottom 0.305: J11.2 88.72,21.04 89.46,20.3 89.46,17.19 86.1,13.83 66.46,13.83 63.06,17.23 57.77,17.23 49.9,25.1 v46.3,25.1
SDA_PIN19  (via drill 0.35)
  Top 0.305: U1.19 46.82,26.38 v47.2,26
  Bottom 0.305: J11.1 87.3,15.73 85.86,14.29 66.65,14.29 63.25,17.69 58.01,17.69 49.7,26 v47.2,26
SW_PIN08  (via drill 0.35)
  Top 0.406: S1.2 18.95,7.25 17.95,8.25 C8.1 R5.1 25.1,12.3 v34.6,21.8 | U1.8 37.65,31.85 34.6,28.8 v34.6,21.8 | 34.6,22.1 v34.6,21.8
  Bottom 0.305: J12.3 96.62,23.58 97.9,22.3 97.9,14.5 94.47,11.07 65.13,11.07 61.8,14.4 40.8,14.4 34.6,20.6 v34.6,21.8
TX_BT
  Top 0.406: Q2.2 R7.1 49.05,5.45 48.2,4.6 45.6,4.6 44.82,3.82 J5.3
TX_PIN21  (via drill 0.35)
  Top 0.305: Q3.3 43.9,11.4 45,12.5 v51.72,12.5 | v53.8,12.5 54.5,13.2 54.5,24.8 54.4,24.9 | U1.21 48.44,27.81 48.44,26.73 48.86,26.3 53,26.3 54.4,24.9 | 54.4,24.9 v54.5,24.9
  Top 0.406: R10.1 43.85,10.3 Q3.3
  Bottom 0.305: v51.72,12.5 v53.8,12.5 | v54.5,24.9 60.8,18.6 63.63,18.6 67.01,15.22 80.72,15.22 82.5,17 82.5,24.6 80.98,26.12 J10.4
UCAP_PIN06  (via drill 0.35)
  Top 0.406: C11.+ 33.15,30.55 36.05,33.45 U1.6
  Bottom 0.305: C11.+ 32.8,21.7 40.6,13.9 61.6,13.9 64.89,10.61 94.71,10.61 98.43,14.33 98.43,24.27 96.58,26.12 J12.4
  other vias: 32.8,30.55
UGND_PIN5  (via drill 0.35)
  Top 0.305: C11.- 32.55,34.4 v32.3,34.4
  Top 0.406: C11.- 33.1,34.35 39.5,34.35 U1.5
  Bottom 0.305: v32.3,34.4 31.5,33.6 31.5,22.3 40.36,13.44 61.26,13.44 64.55,10.15 94.9,10.15 98.89,14.14 98.89,25.79 98.9,25.8 98.9,26.3 96.54,28.66 J12.5
V+  (via drill 0.6)
  Top 0.305: IC1.24 59.57,29.73 60.5,28.8 62.5,28.8 63.7,30 63.7,40.6 | IC3.IN 9.66,51.54 U$4.1
  Top 0.406: IC1.13 IC1.14
  Top 1.27: D5.C 3.4,50.4 4.54,51.54 IC3.IN | IC1.13 58.12,36.7 59.8,36.7 63.7,40.6 63.7,47.6 59,52.3 v49.4,52.3
  Bottom 1.27: v49.4,52.3 8.92,52.3 IC3.IN
XTAL1_PIN17
  Top 0.406: R1.2 C1.2 48.47,22.38 Q1.1 47.06,23.09 45.22,24.93 U1.17
XTAL2_PIN16
  Top 0.406: R1.1 C2.2 41.97,22.38 Q1.2 44.43,24.83 U1.16

### Text on the board
tPlace: +5V | GND | GND | +3V3 | B1 | B2 | Projeto Robótica Móvel nas Escolas | Engineering Lab Unicuritiba 2022 - ROSIE | Professor Carlos Eduardo Setenareski Magrin | Parceria SmartLy Brasil | Design por Marco e Treaquin | R13 | ATMEGA32U4-AU | NC | PIN31 | PIN38 | 1M | PIN27 | PIN32 | PIN39 | PIN28 | PIN33 | PIN40 | + | PIN29 | PIN36 | PIN41 | PIN30 | PIN37 | PIN01 | C10 | PIN20 | PIN11 | PIN05 | C9 | 100nF | PIN21 | PIN12 | PIN06 | 100nF | GND | PIN22 | PIN13 | PIN08 | 270R | 270R | 270R | PIN25 | PIN18 | PIN09 | C2 | C1 | R2 | R3 | R6 | PIN26 | PIN19 | PIN10 | 22pF | R1 | 22pF | 1M | D2 | R5 | R4 | +3V3 | +5V | Led1 | 10k | 10k | A1 | A2 | C8 | C7 | 100nF | 100nF | SW1 | RESET | RX | 3V3